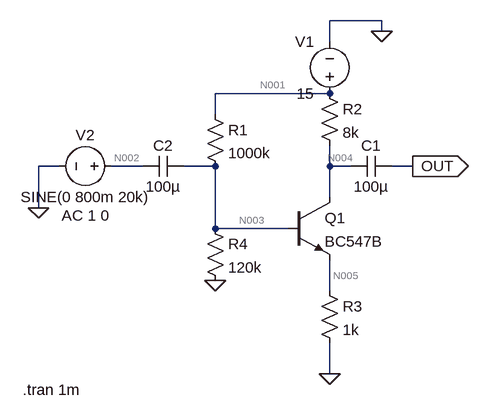
[diagram p0: schematic CE_gain_stage.asc]
CE_gain_stage.asc, the LTspice schematic file:
Version 4
SHEET 1 880 680
WIRE 336 -144 256 -144
WIRE 336 -128 336 -144
WIRE 256 -112 256 -144
WIRE 256 -32 80 -32
WIRE 80 0 80 -32
WIRE -160 80 -192 80
WIRE -32 80 -80 80
WIRE 80 80 32 80
WIRE 256 80 256 48
WIRE 288 80 256 80
WIRE 384 80 352 80
WIRE 256 128 256 80
WIRE -192 144 -192 80
WIRE 80 176 80 80
WIRE 192 176 80 176
WIRE 256 272 256 224
WIRE 256 400 256 352
FLAG 256 400 0
FLAG 336 -128 0
FLAG 384 80 OUT
IOPIN 384 80 Out
FLAG -192 144 0
FLAG 80 256 0
SYMBOL npn 192 128 R0
SYMATTR InstName Q1
SYMATTR Value BC547B
SYMBOL res 240 -48 R0
SYMATTR InstName R2
SYMATTR Value 8k
SYMBOL res 240 256 R0
SYMATTR InstName R3
SYMATTR Value 1k
SYMBOL voltage 256 -16 R180
WINDOW 0 24 96 Left 2
WINDOW 3 24 16 Left 2
WINDOW 123 0 0 Left 0
WINDOW 39 0 0 Left 0
SYMATTR InstName V1
SYMATTR Value 15
SYMBOL cap 352 64 R90
WINDOW 0 0 32 VBottom 2
WINDOW 3 32 32 VTop 2
SYMATTR InstName C1
SYMATTR Value 100µ
SYMBOL voltage -64 80 R90
WINDOW 0 -32 56 VBottom 2
WINDOW 3 32 56 VTop 2
WINDOW 123 60 56 VTop 2
WINDOW 39 0 0 Left 0
SYMATTR InstName V2
SYMATTR Value SINE(0 800m 20k)
SYMATTR Value2 AC 1 0
SYMBOL cap 32 64 R90
WINDOW 0 0 32 VBottom 2
WINDOW 3 32 32 VTop 2
SYMATTR InstName C2
SYMATTR Value 100µ
SYMBOL res 64 160 R0
SYMATTR InstName R4
SYMATTR Value 120k
SYMBOL res 64 -16 R0
SYMATTR InstName R1
SYMATTR Value 1000k
TEXT -216 424 Left 2 !.tran 1m

The netlist it stands for:
* CE_gain_stage.asc
Q1 N004 N003 N005 0 BC547B
R2 N001 N004 8k
R3 N005 0 1k
V1 N001 0 15
C1 OUT N004 100µ
V2 N002 0 SINE(0 800m 20k) AC 1 0
C2 N003 N002 100µ
R4 N003 0 120k
R1 N001 N003 1000k
.model NPN NPN
.model PNP PNP
.lib standard.bjt
.tran 1m
.backanno
.end

* Results of the author's LTspice run, read from the files saved beside the schematic
* Operating Point, zero values left out:
*   V(n004) = 9.149 V
*   V(n003) = 1.361 V
*   V(n005) = 733.6 mV
*   V(n001) = 15 V
*   V(out) = 914.9 µV
*   Ic(Q1) = 731.3 µA
*   Ib(Q1) = 2.296 µA
*   Ie(Q1) = -733.6 µA
*   I(R1) = 13.64 µA
*   I(R4) = 11.34 µA
*   I(R3) = 733.6 µA
*   I(R2) = 731.3 µA
*   I(V1) = -745 µA
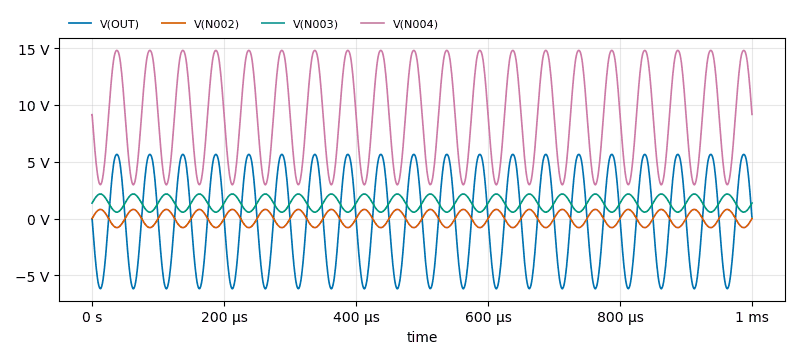
[diagram p1: Transient Analysis of CE_gain_stage.asc, plotted from the saved traces]
* Transient Analysis, 1 run:
*   V(OUT): min -6.183 V, max 5.646 V, average -101.6 mV, rms 4.237 V, last 13.05 mV
*   V(N002): min -800 mV, max 800 mV, average -271.4 nV, rms 565.7 mV, last 0 V
*   V(N003): min 563.1 mV, max 2.159 V, average 1.361 V, rms 1.473 V, last 1.361 V
*   V(N004): min 2.966 V, max 14.79 V, average 9.047 V, rms 9.989 V, last 9.162 V